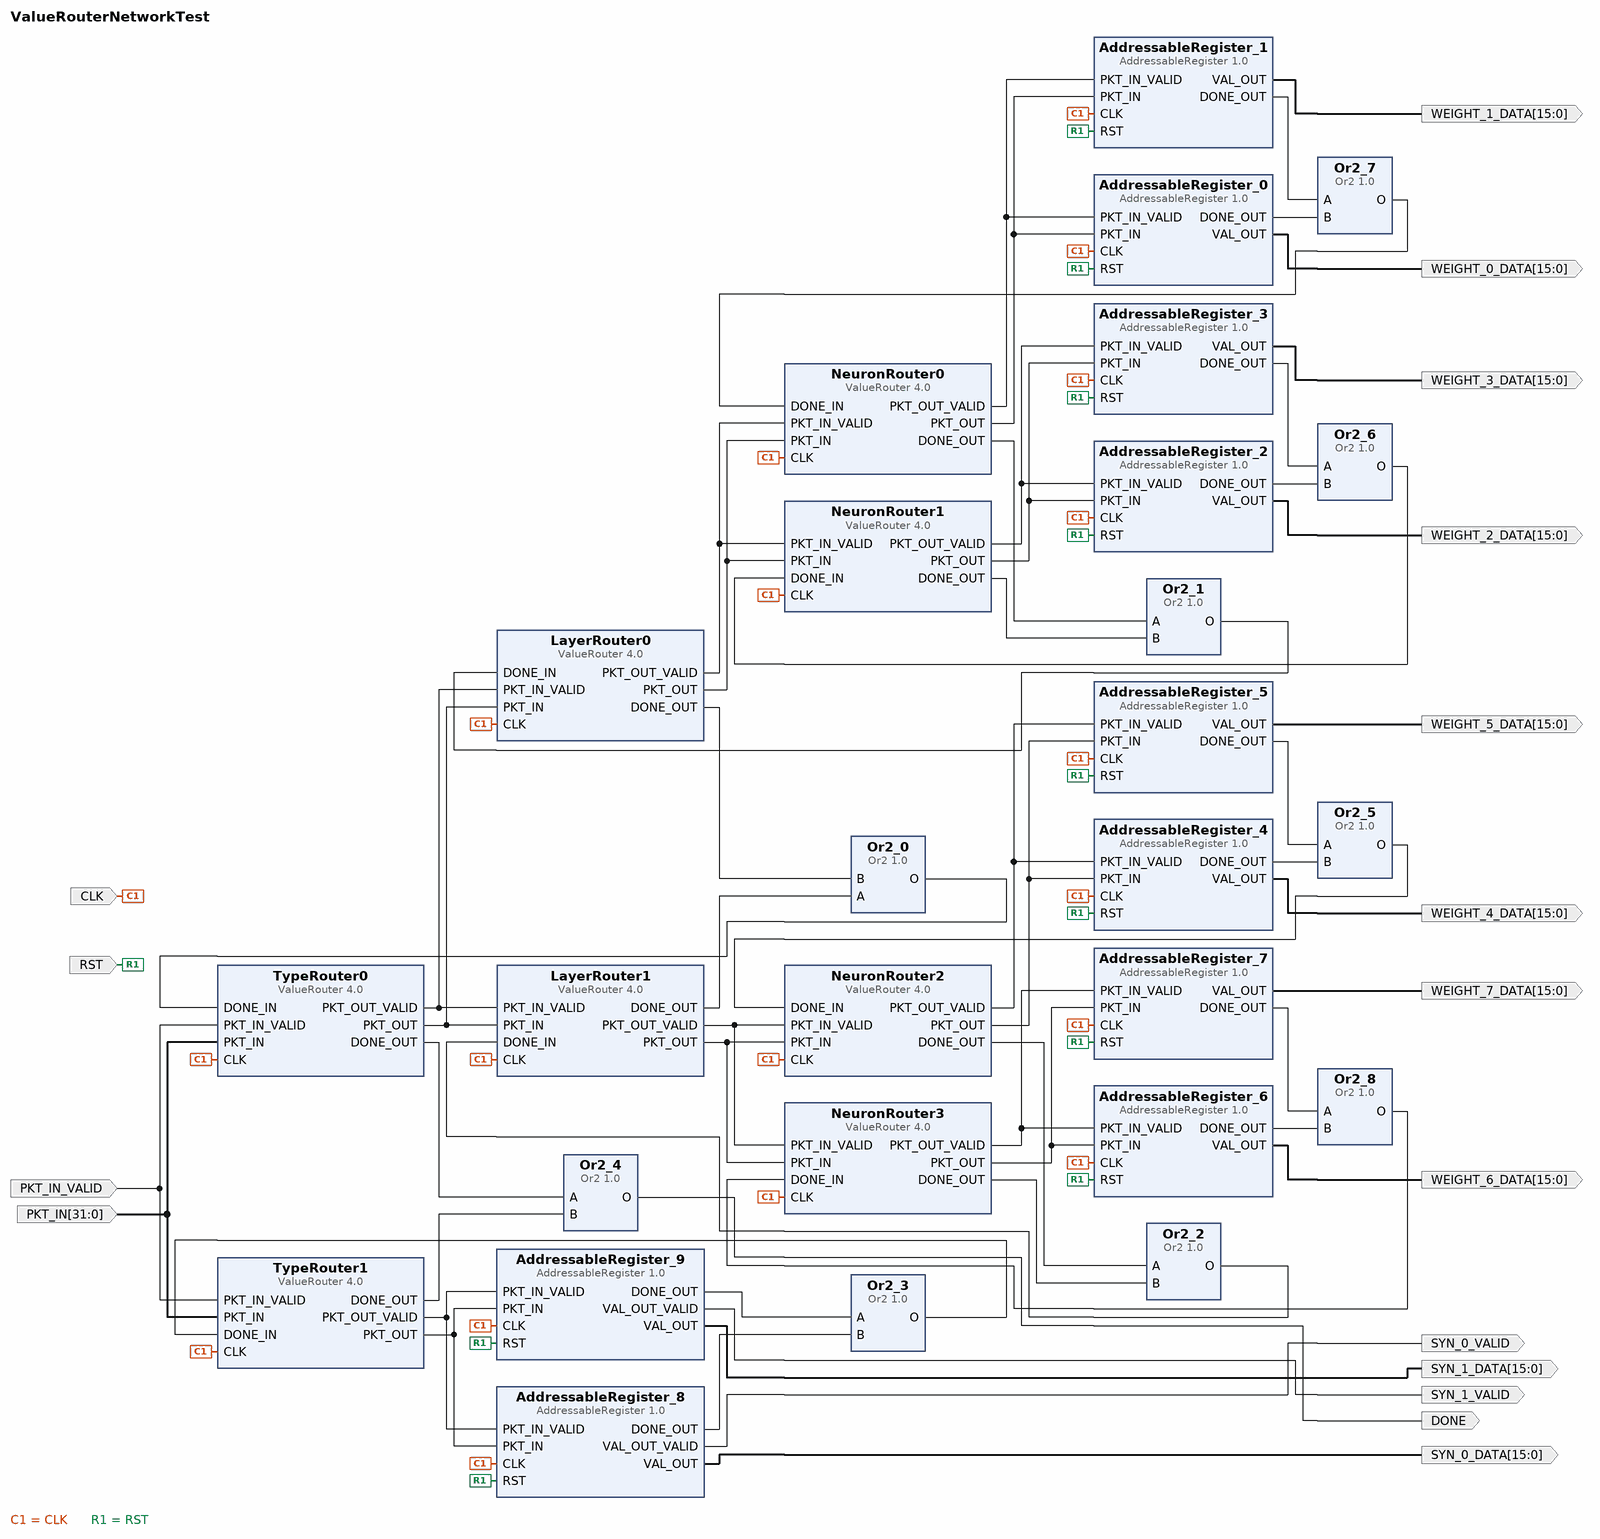
[diagram p0: block diagram of the top level]
# Vivado block design ValueRouterNetworkTest, Vivado 2014.2
create_bd_design ValueRouterNetworkTest

create_bd_port -dir I -type clk CLK
create_bd_port -dir I PKT_IN_VALID
create_bd_port -dir I -from 31 -to 0 -type data PKT_IN
create_bd_port -dir I -type rst RST
create_bd_port -dir O SYN_0_VALID
create_bd_port -dir O SYN_1_VALID
create_bd_port -dir O -from 15 -to 0 -type data SYN_0_DATA
create_bd_port -dir O -from 15 -to 0 -type data SYN_1_DATA
create_bd_port -dir O -from 15 -to 0 -type data WEIGHT_3_DATA
create_bd_port -dir O -from 15 -to 0 -type data WEIGHT_2_DATA
create_bd_port -dir O -from 15 -to 0 -type data WEIGHT_0_DATA
create_bd_port -dir O -from 15 -to 0 -type data WEIGHT_1_DATA
create_bd_port -dir O -from 15 -to 0 -type data WEIGHT_7_DATA
create_bd_port -dir O -from 15 -to 0 -type data WEIGHT_6_DATA
create_bd_port -dir O -from 15 -to 0 -type data WEIGHT_4_DATA
create_bd_port -dir O -from 15 -to 0 -type data WEIGHT_5_DATA
create_bd_port -dir O DONE

create_bd_cell -type ip -vlnv xilinx.com:ip:Or2:1.0 Or2_0
create_bd_cell -type ip -vlnv xilinx.com:ip:Or2:1.0 Or2_1
create_bd_cell -type ip -vlnv xilinx.com:ip:Or2:1.0 Or2_2
create_bd_cell -type ip -vlnv oloftus.com:prif:AddressableRegister:1.0 AddressableRegister_8
set_property -dict {CONFIG.address 16384 CONFIG.addressWidth 15 CONFIG.dataWidth 16} [get_bd_cells AddressableRegister_8]
create_bd_cell -type ip -vlnv oloftus.com:prif:AddressableRegister:1.0 AddressableRegister_9
set_property -dict {CONFIG.address 16385 CONFIG.addressWidth 15 CONFIG.dataWidth 16} [get_bd_cells AddressableRegister_9]
create_bd_cell -type ip -vlnv xilinx.com:ip:Or2:1.0 Or2_3
create_bd_cell -type ip -vlnv xilinx.com:ip:Or2:1.0 Or2_4
create_bd_cell -type ip -vlnv oloftus.com:prif:AddressableRegister:1.0 AddressableRegister_3
set_property -dict {CONFIG.address 11 CONFIG.addressWidth 4 CONFIG.dataWidth 16} [get_bd_cells AddressableRegister_3]
create_bd_cell -type ip -vlnv oloftus.com:prif:AddressableRegister:1.0 AddressableRegister_2
set_property -dict {CONFIG.address 10 CONFIG.addressWidth 4 CONFIG.dataWidth 16} [get_bd_cells AddressableRegister_2]
create_bd_cell -type ip -vlnv oloftus.com:prif:AddressableRegister:1.0 AddressableRegister_0
set_property -dict {CONFIG.address 8 CONFIG.addressWidth 4 CONFIG.dataWidth 16} [get_bd_cells AddressableRegister_0]
create_bd_cell -type ip -vlnv oloftus.com:prif:AddressableRegister:1.0 AddressableRegister_1
set_property -dict {CONFIG.address 9 CONFIG.addressWidth 4 CONFIG.dataWidth 16} [get_bd_cells AddressableRegister_1]
create_bd_cell -type ip -vlnv oloftus.com:prif:AddressableRegister:1.0 AddressableRegister_7
set_property -dict {CONFIG.address 15 CONFIG.addressWidth 4 CONFIG.dataWidth 16} [get_bd_cells AddressableRegister_7]
create_bd_cell -type ip -vlnv oloftus.com:prif:AddressableRegister:1.0 AddressableRegister_6
set_property -dict {CONFIG.address 14 CONFIG.addressWidth 4 CONFIG.dataWidth 16} [get_bd_cells AddressableRegister_6]
create_bd_cell -type ip -vlnv oloftus.com:prif:AddressableRegister:1.0 AddressableRegister_4
set_property -dict {CONFIG.address 12 CONFIG.addressWidth 4 CONFIG.dataWidth 16} [get_bd_cells AddressableRegister_4]
create_bd_cell -type ip -vlnv oloftus.com:prif:AddressableRegister:1.0 AddressableRegister_5
set_property -dict {CONFIG.address 13 CONFIG.addressWidth 4 CONFIG.dataWidth 16} [get_bd_cells AddressableRegister_5]
create_bd_cell -type ip -vlnv xilinx.com:ip:Or2:1.0 Or2_5
create_bd_cell -type ip -vlnv xilinx.com:ip:Or2:1.0 Or2_6
create_bd_cell -type ip -vlnv xilinx.com:ip:Or2:1.0 Or2_7
create_bd_cell -type ip -vlnv xilinx.com:ip:Or2:1.0 Or2_8
create_bd_cell -type ip -vlnv oloftus.com:prif:ValueRouter:4.0 LayerRouter0
set_property -dict {CONFIG.packetOutWidth 26 CONFIG.packetInWidth 31 CONFIG.address 16} [get_bd_cells LayerRouter0]
create_bd_cell -type ip -vlnv oloftus.com:prif:ValueRouter:4.0 LayerRouter1
set_property -dict {CONFIG.packetOutWidth 26 CONFIG.packetInWidth 31 CONFIG.address 17} [get_bd_cells LayerRouter1]
create_bd_cell -type ip -vlnv oloftus.com:prif:ValueRouter:4.0 NeuronRouter0
set_property -dict {CONFIG.packetOutWidth 20 CONFIG.packetInWidth 26 CONFIG.address 32} [get_bd_cells NeuronRouter0]
create_bd_cell -type ip -vlnv oloftus.com:prif:ValueRouter:4.0 NeuronRouter1
set_property -dict {CONFIG.packetOutWidth 20 CONFIG.packetInWidth 26 CONFIG.address 33} [get_bd_cells NeuronRouter1]
create_bd_cell -type ip -vlnv oloftus.com:prif:ValueRouter:4.0 NeuronRouter2
set_property -dict {CONFIG.packetOutWidth 20 CONFIG.packetInWidth 26 CONFIG.address 34} [get_bd_cells NeuronRouter2]
create_bd_cell -type ip -vlnv oloftus.com:prif:ValueRouter:4.0 NeuronRouter3
set_property -dict {CONFIG.packetOutWidth 20 CONFIG.packetInWidth 26 CONFIG.address 35} [get_bd_cells NeuronRouter3]
create_bd_cell -type ip -vlnv oloftus.com:prif:ValueRouter:4.0 TypeRouter0
set_property -dict {CONFIG.packetOutWidth 31 CONFIG.packetInWidth 32} [get_bd_cells TypeRouter0]
create_bd_cell -type ip -vlnv oloftus.com:prif:ValueRouter:4.0 TypeRouter1
set_property -dict {CONFIG.packetOutWidth 31 CONFIG.packetInWidth 32 CONFIG.address 1} [get_bd_cells TypeRouter1]

# ---- connections ----

connect_bd_net [get_bd_ports CLK] \
  [get_bd_pins AddressableRegister_8/CLK] [get_bd_pins AddressableRegister_9/CLK] [get_bd_pins AddressableRegister_3/CLK] \
  [get_bd_pins AddressableRegister_2/CLK] [get_bd_pins AddressableRegister_0/CLK] [get_bd_pins AddressableRegister_1/CLK] \
  [get_bd_pins AddressableRegister_7/CLK] [get_bd_pins AddressableRegister_6/CLK] [get_bd_pins AddressableRegister_5/CLK] \
  [get_bd_pins AddressableRegister_4/CLK] [get_bd_pins LayerRouter0/CLK] [get_bd_pins LayerRouter1/CLK] \
  [get_bd_pins NeuronRouter0/CLK] [get_bd_pins NeuronRouter1/CLK] [get_bd_pins NeuronRouter2/CLK] \
  [get_bd_pins NeuronRouter3/CLK] [get_bd_pins TypeRouter0/CLK] [get_bd_pins TypeRouter1/CLK]
connect_bd_net [get_bd_ports PKT_IN_VALID] [get_bd_pins TypeRouter0/PKT_IN_VALID] [get_bd_pins TypeRouter1/PKT_IN_VALID]
connect_bd_net [get_bd_pins TypeRouter0/PKT_OUT_VALID] [get_bd_pins LayerRouter0/PKT_IN_VALID] [get_bd_pins LayerRouter1/PKT_IN_VALID]
connect_bd_net [get_bd_pins TypeRouter0/PKT_OUT] [get_bd_pins LayerRouter0/PKT_IN] [get_bd_pins LayerRouter1/PKT_IN]
connect_bd_net [get_bd_pins Or2_0/O] [get_bd_pins TypeRouter0/DONE_IN]
connect_bd_net [get_bd_pins LayerRouter0/DONE_OUT] [get_bd_pins Or2_0/B]
connect_bd_net [get_bd_pins LayerRouter1/DONE_OUT] [get_bd_pins Or2_0/A]
connect_bd_net [get_bd_pins LayerRouter0/PKT_OUT_VALID] [get_bd_pins NeuronRouter0/PKT_IN_VALID] [get_bd_pins NeuronRouter1/PKT_IN_VALID]
connect_bd_net [get_bd_pins LayerRouter1/PKT_OUT_VALID] [get_bd_pins NeuronRouter2/PKT_IN_VALID] [get_bd_pins NeuronRouter3/PKT_IN_VALID]
connect_bd_net [get_bd_pins LayerRouter0/PKT_OUT] [get_bd_pins NeuronRouter0/PKT_IN] [get_bd_pins NeuronRouter1/PKT_IN]
connect_bd_net [get_bd_pins LayerRouter1/PKT_OUT] [get_bd_pins NeuronRouter2/PKT_IN] [get_bd_pins NeuronRouter3/PKT_IN]
connect_bd_net [get_bd_pins Or2_1/O] [get_bd_pins LayerRouter0/DONE_IN]
connect_bd_net -net NeuronRouter2_DONE_OUT [get_bd_pins NeuronRouter1/DONE_OUT] [get_bd_pins Or2_1/B]
connect_bd_net [get_bd_pins NeuronRouter0/DONE_OUT] [get_bd_pins Or2_1/A]
connect_bd_net [get_bd_pins Or2_2/O] [get_bd_pins LayerRouter1/DONE_IN]
connect_bd_net -net NeuronRouter1_DONE_OUT [get_bd_pins NeuronRouter3/DONE_OUT] [get_bd_pins Or2_2/B]
connect_bd_net -net NeuronRouter3_DONE_OUT [get_bd_pins NeuronRouter2/DONE_OUT] [get_bd_pins Or2_2/A]
connect_bd_net [get_bd_pins TypeRouter1/PKT_OUT_VALID] \
  [get_bd_pins AddressableRegister_8/PKT_IN_VALID] [get_bd_pins AddressableRegister_9/PKT_IN_VALID]
connect_bd_net [get_bd_pins TypeRouter1/PKT_OUT] [get_bd_pins AddressableRegister_8/PKT_IN] [get_bd_pins AddressableRegister_9/PKT_IN]
connect_bd_net -net AddressableRegister_0_DONE_OUT [get_bd_pins AddressableRegister_8/DONE_OUT] [get_bd_pins Or2_3/B]
connect_bd_net -net AddressableRegister_1_DONE_OUT [get_bd_pins AddressableRegister_9/DONE_OUT] [get_bd_pins Or2_3/A]
connect_bd_net [get_bd_ports PKT_IN] [get_bd_pins TypeRouter0/PKT_IN] [get_bd_pins TypeRouter1/PKT_IN]
connect_bd_net [get_bd_pins Or2_3/O] [get_bd_pins TypeRouter1/DONE_IN]
connect_bd_net [get_bd_pins TypeRouter0/DONE_OUT] [get_bd_pins Or2_4/A]
connect_bd_net [get_bd_pins TypeRouter1/DONE_OUT] [get_bd_pins Or2_4/B]
connect_bd_net [get_bd_ports RST] \
  [get_bd_pins AddressableRegister_3/RST] [get_bd_pins AddressableRegister_2/RST] [get_bd_pins AddressableRegister_0/RST] \
  [get_bd_pins AddressableRegister_1/RST] [get_bd_pins AddressableRegister_7/RST] [get_bd_pins AddressableRegister_6/RST] \
  [get_bd_pins AddressableRegister_5/RST] [get_bd_pins AddressableRegister_8/RST] [get_bd_pins AddressableRegister_9/RST] \
  [get_bd_pins AddressableRegister_4/RST]
connect_bd_net -net NeuronRouter2_PKT_OUT_VALID [get_bd_pins NeuronRouter1/PKT_OUT_VALID] \
  [get_bd_pins AddressableRegister_3/PKT_IN_VALID] [get_bd_pins AddressableRegister_2/PKT_IN_VALID]
connect_bd_net [get_bd_pins NeuronRouter0/PKT_OUT_VALID] \
  [get_bd_pins AddressableRegister_0/PKT_IN_VALID] [get_bd_pins AddressableRegister_1/PKT_IN_VALID]
connect_bd_net -net NeuronRouter1_PKT_OUT_VALID [get_bd_pins NeuronRouter3/PKT_OUT_VALID] \
  [get_bd_pins AddressableRegister_7/PKT_IN_VALID] [get_bd_pins AddressableRegister_6/PKT_IN_VALID]
connect_bd_net -net NeuronRouter3_PKT_OUT_VALID [get_bd_pins NeuronRouter2/PKT_OUT_VALID] \
  [get_bd_pins AddressableRegister_4/PKT_IN_VALID] [get_bd_pins AddressableRegister_5/PKT_IN_VALID]
connect_bd_net -net NeuronRouter3_PKT_OUT [get_bd_pins NeuronRouter2/PKT_OUT] \
  [get_bd_pins AddressableRegister_5/PKT_IN] [get_bd_pins AddressableRegister_4/PKT_IN]
connect_bd_net -net NeuronRouter1_PKT_OUT [get_bd_pins NeuronRouter3/PKT_OUT] \
  [get_bd_pins AddressableRegister_7/PKT_IN] [get_bd_pins AddressableRegister_6/PKT_IN]
connect_bd_net [get_bd_pins NeuronRouter0/PKT_OUT] [get_bd_pins AddressableRegister_1/PKT_IN] [get_bd_pins AddressableRegister_0/PKT_IN]
connect_bd_net -net NeuronRouter2_PKT_OUT [get_bd_pins NeuronRouter1/PKT_OUT] \
  [get_bd_pins AddressableRegister_2/PKT_IN] [get_bd_pins AddressableRegister_3/PKT_IN]
connect_bd_net -net AddressableRegister_0_VAL_OUT_VALID [get_bd_pins AddressableRegister_8/VAL_OUT_VALID] [get_bd_ports SYN_0_VALID]
connect_bd_net -net AddressableRegister_1_VAL_OUT_VALID [get_bd_pins AddressableRegister_9/VAL_OUT_VALID] [get_bd_ports SYN_1_VALID]
connect_bd_net -net AddressableRegister_0_VAL_OUT [get_bd_pins AddressableRegister_8/VAL_OUT] [get_bd_ports SYN_0_DATA]
connect_bd_net -net AddressableRegister_1_VAL_OUT [get_bd_pins AddressableRegister_9/VAL_OUT] [get_bd_ports SYN_1_DATA]
connect_bd_net -net AddressableRegister_2_VAL_OUT [get_bd_pins AddressableRegister_3/VAL_OUT] [get_bd_ports WEIGHT_3_DATA]
connect_bd_net -net AddressableRegister_3_VAL_OUT [get_bd_pins AddressableRegister_2/VAL_OUT] [get_bd_ports WEIGHT_2_DATA]
connect_bd_net -net AddressableRegister_4_VAL_OUT [get_bd_pins AddressableRegister_0/VAL_OUT] [get_bd_ports WEIGHT_0_DATA]
connect_bd_net -net AddressableRegister_5_VAL_OUT [get_bd_pins AddressableRegister_1/VAL_OUT] [get_bd_ports WEIGHT_1_DATA]
connect_bd_net -net AddressableRegister_6_VAL_OUT [get_bd_pins AddressableRegister_7/VAL_OUT] [get_bd_ports WEIGHT_7_DATA]
connect_bd_net -net AddressableRegister_7_VAL_OUT [get_bd_pins AddressableRegister_6/VAL_OUT] [get_bd_ports WEIGHT_6_DATA]
connect_bd_net -net AddressableRegister_8_VAL_OUT [get_bd_pins AddressableRegister_4/VAL_OUT] [get_bd_ports WEIGHT_4_DATA]
connect_bd_net -net AddressableRegister_9_VAL_OUT [get_bd_pins AddressableRegister_5/VAL_OUT] [get_bd_ports WEIGHT_5_DATA]
connect_bd_net [get_bd_pins Or2_5/O] [get_bd_pins NeuronRouter2/DONE_IN]
connect_bd_net -net AddressableRegister_8_DONE_OUT [get_bd_pins AddressableRegister_4/DONE_OUT] [get_bd_pins Or2_5/B]
connect_bd_net -net AddressableRegister_9_DONE_OUT [get_bd_pins AddressableRegister_5/DONE_OUT] [get_bd_pins Or2_5/A]
connect_bd_net [get_bd_pins Or2_8/O] [get_bd_pins NeuronRouter3/DONE_IN]
connect_bd_net -net AddressableRegister_6_DONE_OUT [get_bd_pins AddressableRegister_7/DONE_OUT] [get_bd_pins Or2_8/A]
connect_bd_net -net AddressableRegister_7_DONE_OUT [get_bd_pins AddressableRegister_6/DONE_OUT] [get_bd_pins Or2_8/B]
connect_bd_net [get_bd_pins Or2_7/O] [get_bd_pins NeuronRouter0/DONE_IN]
connect_bd_net -net AddressableRegister_4_DONE_OUT [get_bd_pins AddressableRegister_0/DONE_OUT] [get_bd_pins Or2_7/B]
connect_bd_net -net AddressableRegister_5_DONE_OUT [get_bd_pins AddressableRegister_1/DONE_OUT] [get_bd_pins Or2_7/A]
connect_bd_net [get_bd_pins Or2_6/O] [get_bd_pins NeuronRouter1/DONE_IN]
connect_bd_net -net AddressableRegister_3_DONE_OUT [get_bd_pins AddressableRegister_2/DONE_OUT] [get_bd_pins Or2_6/B]
connect_bd_net -net AddressableRegister_2_DONE_OUT [get_bd_pins AddressableRegister_3/DONE_OUT] [get_bd_pins Or2_6/A]
connect_bd_net [get_bd_pins Or2_4/O] [get_bd_ports DONE]

validate_bd_design
save_bd_design
